# EAGLE design Breakout (EAGLE 9.4.2)
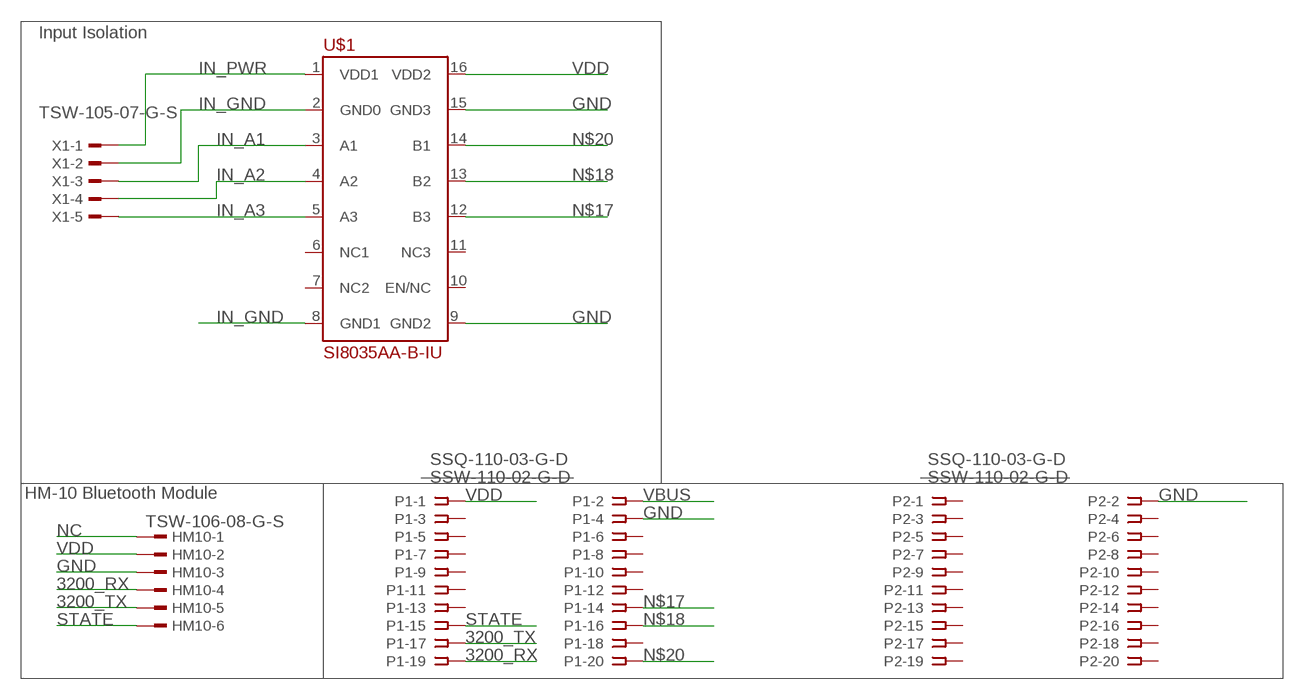
[diagram p0: schematic, sheet 1]

## Parts
HM10  TSW-106-08-G-S  [TSW-106-XX-G-S]
P1  SSW-110-02-G-D  [SSW-110-02-G-D]
P2  SSW-110-02-G-D  [SSW-110-02-G-D]
U$1  SI8035AA-B-IU  [SOP63P602X175-16N]
X1  TSW-105-07-G-S  [TSW-105-XX-G-S]

## Nets
3200_RX: HM10.4 P1.19
3200_TX: HM10.5 P1.17
GND: HM10.3 P1.4 P2.2 U$1.9(GND2) U$1.15(GND3)
IN_A1: U$1.3(A1) X1.3
IN_A2: U$1.4(A2) X1.4
IN_A3: U$1.5(A3) X1.5
IN_GND: U$1.2(GND0) U$1.8(GND1) X1.2
IN_PWR: U$1.1(VDD1) X1.1
N$17: P1.14 U$1.12(B3)
N$18: P1.16 U$1.13(B2)
N$20: P1.20 U$1.14(B1)
NC: HM10.1
STATE: HM10.6 P1.15
VBUS: P1.2
VDD: HM10.2 P1.1 U$1.16(VDD2)
Unconnected: P1.3 P1.5 P1.6 P1.7 P1.8 P1.9 P1.10 P1.11 P1.12 P1.13 P1.18 P2.1 P2.3 P2.4 P2.5 P2.6 P2.7 P2.8 P2.9 P2.10 P2.11 P2.12 P2.13 P2.14 P2.15 P2.16 P2.17 P2.18 P2.19 P2.20 U$1.6(NC1) U$1.7(NC2) U$1.10(EN/NC) U$1.11(NC3)

## Notes on the sheet
- Input Isolation
- SSQ-110-03-G-D | SSQ-110-03-G-D
- HM-10 Bluetooth Module

## Library data of the parts
HM10 = con-samtec:TSW-106-*-G-S: THROUGH-HOLE .025" SQ POST HEADER Source: Samtec TSW.pdf; MF: Samtec Inc.; MPN: TSW-106-07-G-S
P1 P2 = con-samtec:SSW-110-02-G: THROUGH-HOLE .025" SQ POST SOCKET Source: Samtec SSW.pdf; MF: Samtec Inc.; MPN: SSW-110-02-G-D; OC_FARNELL: unknown; OC_NEWARK: 11P9480
U$1 = SOP63P602X175-16N:SI8035AA-B-IU
X1 = con-samtec:TSW-105-*-G-S: THROUGH-HOLE .025" SQ POST HEADER Source: Samtec TSW.pdf; MF: Samtec Inc.; MPN: TSW-105-07-G-S

## Board
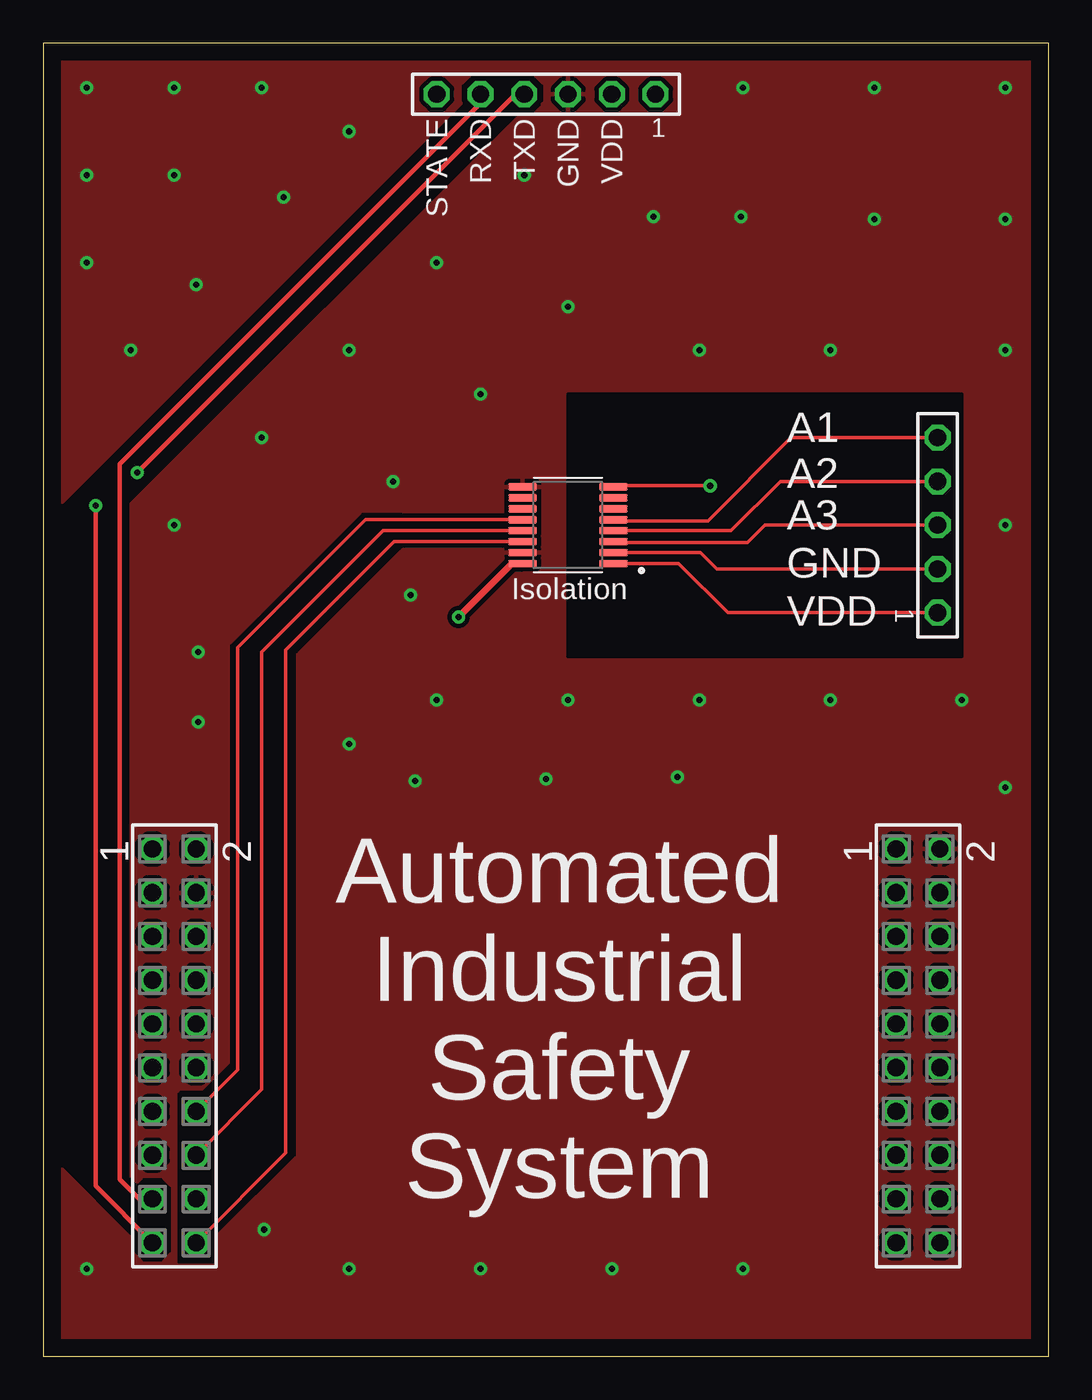
[diagram p1: board, top side]
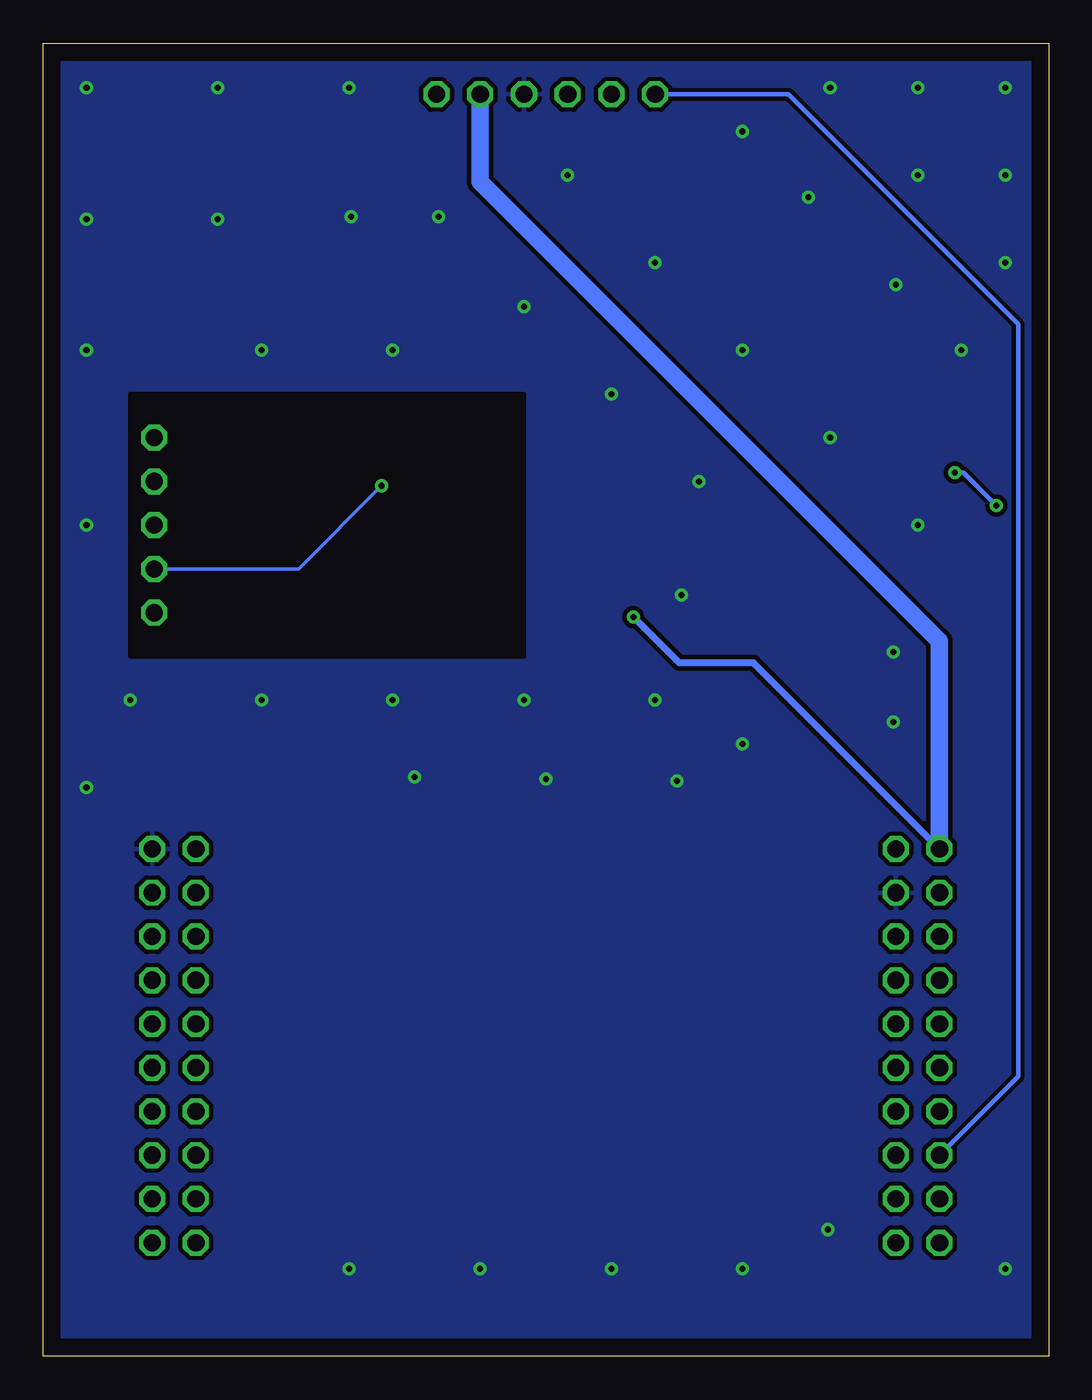
[diagram p2: board, bottom side, seen from below]

Size 58.4 x 76.25 mm. Coordinates in mm from the lower left corner, seen from the top.
Outline: 0,0 58.4,0 58.4,76.25 0,76.25 0,0
Copper layers (1*16): Top 0.035mm / dielectric 1.5mm / Bottom 0.035mm
Design rules "default": minimum track width 6mil, minimum drill 0.35mm, track to track 6mil, track to pad 6mil, pad to pad 6mil, via to via 6mil, smd to smd 6mil, copper to edge 40mil, drill to drill 6mil, minimum pad ring 10mil, minimum via ring 8mil, stop-mask expansion 4mil, vias tented up to drill 0mil, thermal gap 10mil

### Footprints (pad centres in the part's own frame; a part is rotated, then mirrored left to right if it is on the bottom)
TSW-106-XX-G-S = drill 1 pad 1.5 octagon: 1 6.35,0; 2 3.81,0; 3 1.27,0; 4 -1.27,0; 5 -3.81,0; 6 -6.35,0
SSW-110-02-G-D = drill 1 pad 1.5 octagon: 1 -11.43,-1.27; 2 -11.43,1.27; 3 -8.89,-1.27; 4 -8.89,1.27; 5 -6.35,-1.27; 6 -6.35,1.27; 7 -3.81,-1.27; 8 -3.81,1.27; 9 -1.27,-1.27; 10 -1.27,1.27; 11 1.27,-1.27; 12 1.27,1.27; 13 3.81,-1.27; 14 3.81,1.27; 15 6.35,-1.27; 16 6.35,1.27; 17 8.89,-1.27; 18 8.89,1.27; 19 11.43,-1.27; 20 11.43,1.27
SOP63P602X175-16N = smd 1.64 x 0.41: 1 -2.635,2.223; 2 -2.635,1.587; 3 -2.635,0.953; 4 -2.635,0.318; 5 -2.635,-0.318; 6 -2.635,-0.953; 7 -2.635,-1.587; 8 -2.635,-2.223; 9 2.635,-2.223; 10 2.635,-1.587; 11 2.635,-0.953; 12 2.635,-0.318; 13 2.635,0.318; 14 2.635,0.953; 15 2.635,1.587; 16 2.635,2.223
TSW-105-XX-G-S = drill 1 pad 1.5 octagon: 1 5.08,0; 2 2.54,0; 3 0,0; 4 -2.54,0; 5 -5.08,0

### Placement (x,y rotation side)
HM10  29.21,73.28 0 top
P1  7.62,18.03 270 top
P2  50.8,18.03 270 top
U$1  30.48,48.26 180 top
X1  51.94,48.26 270 top

### Tracks (layer width: path | path; a pad name or v marks a point on that pad's centre or on a via)
3200_RX  (via drill 0.35)
  Top 0.254: P1.19 3.05,9.91 v3.05,49.4 | v5.46,51.31 27.43,73.28 HM10.4
  Bottom 0.254: v3.05,49.4 4.95,51.31 v5.46,51.31
3200_TX
  Top 0.254: P1.17 5.59,9.14 4.45,10.29 4.45,51.82 25.4,72.77 HM10.5
EXT_GND
  cutout Bottom (isolate 0.254): 30.48,55.88 53.34,55.88 53.34,40.64 30.48,40.64
GND  (via drill 0.35)
  other vias: 2.54,73.66 2.54,68.58 2.54,63.5 5.08,58.42 7.62,73.66 7.62,68.58 8.89,62.23 17.78,71.12 12.7,73.66 13.97,67.31 27.94,68.58 22.86,63.5 17.78,58.42 12.7,53.34 7.62,48.26 40.64,73.66 48.26,73.66 40.51,66.17 55.88,73.66 48.26,66.04 38.1,58.42 45.72,58.42 55.88,58.42 55.88,48.26 53.34,38.1 55.88,33.02 35.43,66.17 30.48,60.96 25.4,55.88 20.32,50.8 21.34,44.2 9.02,40.89 9.02,36.83 45.72,38.1 38.1,38.1 30.48,38.1 22.86,38.1 17.78,35.56 12.83,7.37 2.54,5.08 17.78,5.08 25.4,5.08 33.02,5.08 40.64,5.08 36.83,33.66 29.21,33.53 21.59,33.4 55.88,66.04
  pour Top (isolate 0.254): 0,76.2 58.42,76.2 58.42,0 0,0
  pour Bottom (isolate 0.254): 0,76.2 58.42,76.2 58.42,0 0,0
IN_A1
  Top 0.203: X1.3 41.91,48.26 40.89,47.24 33.18,47.24 U$1.3
IN_A2
  Top 0.203: X1.4 42.8,50.8 39.94,47.94 U$1.4
IN_A3
  Top 0.203: X1.5 43.43,53.34 38.61,48.51 33.18,48.51 U$1.5
IN_GND  (via drill 0.35)
  Top 0.203: X1.2 39.12,45.72 38.16,46.67 U$1.2 | v38.73,50.55 33.18,50.55
  Top 0.254: 33.18,50.55 U$1.8
  Bottom 0.203: v38.73,50.55 43.56,45.72 X1.2
  cutout Top: 53.34,55.88 53.34,40.64 30.48,40.64 30.48,55.88
IN_PWR
  Top 0.203: X1.1 39.75,43.18 36.89,46.04 U$1.1
N$17
  Top 0.203: U$1.12 18.73,48.58 11.3,41.15 11.3,16.64 P1.14
N$18
  Top 0.203: P1.16 12.7,15.49 12.7,40.89 19.75,47.94 U$1.13
N$20
  Top 0.203: P1.20 14.1,11.81 14.1,41.02 20.38,47.31 U$1.14
NOTGND
  cutout Top: 9.27,15.37 10.92,17.02 10.92,41.27 18.54,48.9 20.83,48.9 20.83,46.99 20.7,46.86 14.73,40.89 14.61,40.89 14.61,11.68 10.03,7.11 10.03,5.59 9.91,5.46 7.87,5.46 7.87,15.24 8,15.37
NOTGND2
  cutout Top: 5.33,6.99 5.33,6.1 5.84,5.59 6.86,5.59 7.37,6.1 7.37,9.78 6.86,10.29 5.84,10.29 5.46,9.91 4.95,10.41 4.95,49.53 27.69,72.26 28.45,72.26 28.83,72.64 28.83,72.77 28.96,72.9 28.96,73.79 28.32,74.42 25.02,74.42 24.38,73.79 24.38,72.9 24.51,72.77 1.02,49.28 1.02,11.18 5.21,6.99
STATE
  Bottom 0.254: P1.15 1.78,16.26 1.78,59.94 15.11,73.28 HM10.6
VDD  (via drill 0.35)
  Top 0.406: v24.13,42.93 27.24,46.04 U$1.16
  Bottom 0.406: P1.1 17.14,40.26 21.46,40.26 v24.13,42.93
  Bottom 1.016: P1.1 6.35,41.53 33.02,68.2 HM10.2

### Text on the board
tPlace: STATE | RXD | TXD | GND | VDD | A1 | A2 | A3 | GND | Isolation | VDD | Automated / Industrial / Safety / System